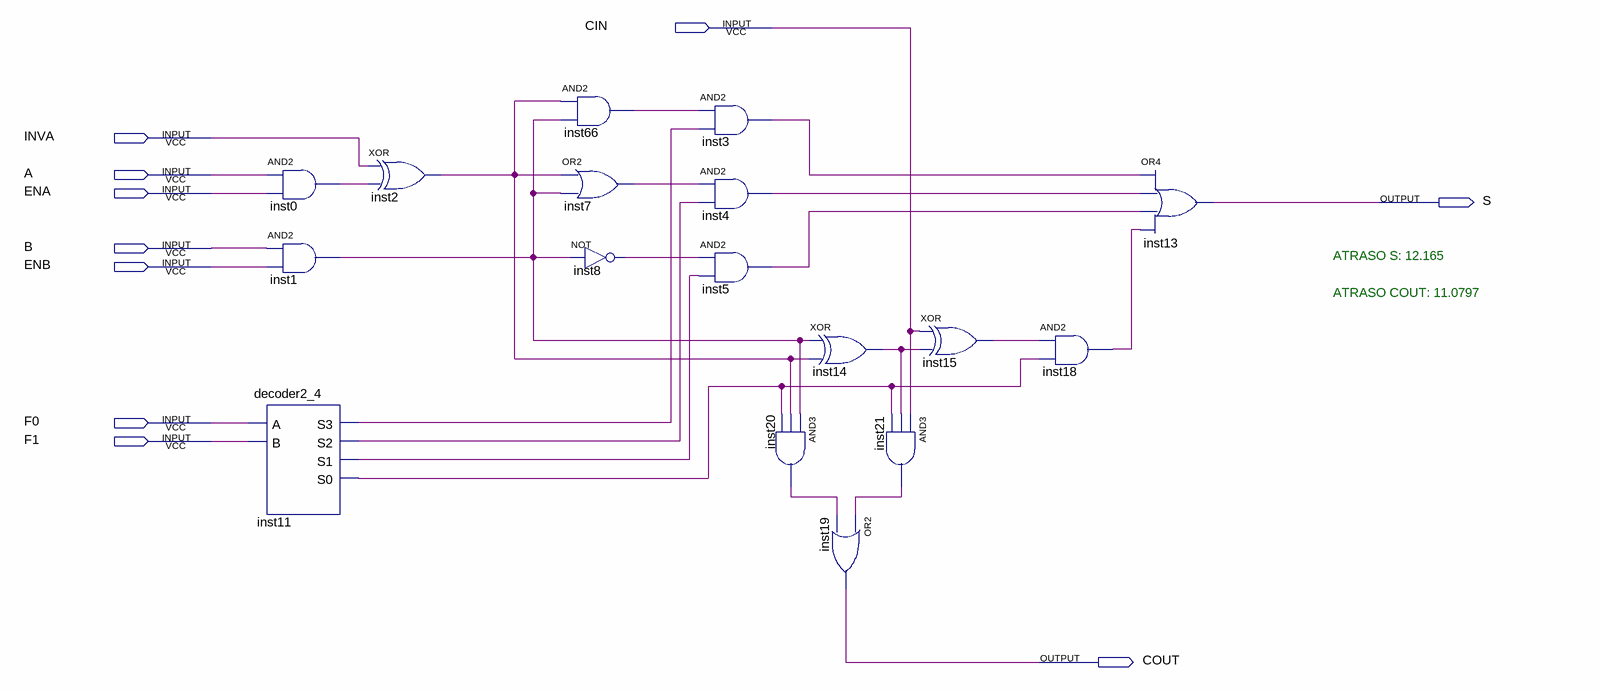
[diagram p0: schematic sheet]
// Quartus schematic ULA_1bit.bdf as structural Verilog: 17 symbols, 10 pins
module ULA_1bit (
  input  CIN,
  input  INVA,
  input  A,
  input  ENA,
  input  B,
  input  ENB,
  input  F0,
  input  F1,
  output S,
  output COUT
);

  wire inst0_out, inst1_out, inst2_out, inst3_out, inst4_out, inst5_out, inst7_out, inst8_out, inst11_s0,
       inst11_s1, inst11_s2, inst11_s3, inst14_out, inst15_out, inst18_out, inst20_out, inst21_out,
       inst66_out;

  and inst0 (inst0_out, A, ENA);
  and inst1 (inst1_out, B, ENB);
  decoder2_4 inst11 (.A(F0), .B(F1), .S3(inst11_s3), .S2(inst11_s2), .S1(inst11_s1), .S0(inst11_s0));
  xor inst2 (inst2_out, INVA, inst0_out);
  and inst66 (inst66_out, inst2_out, inst1_out);
  or inst7 (inst7_out, inst2_out, inst1_out);
  not inst8 (inst8_out, inst1_out);
  and inst3 (inst3_out, inst66_out, inst11_s3);
  and inst4 (inst4_out, inst7_out, inst11_s2);
  and inst5 (inst5_out, inst8_out, inst11_s1);
  and inst20 (inst20_out, inst1_out, inst2_out, inst11_s0);
  xor inst14 (inst14_out, inst1_out, inst2_out);
  and inst21 (inst21_out, CIN, inst14_out, inst11_s0);
  or inst19 (COUT, inst21_out, inst20_out);
  xor inst15 (inst15_out, CIN, inst14_out);
  and inst18 (inst18_out, inst15_out, inst11_s0);
  or inst13 (S, inst3_out, inst4_out, inst5_out, inst18_out);

  // Notes on the sheet:
  //   ATRASO S: 12.165
  //   ATRASO COUT: 11.0797
endmodule
